# EAGLE schematic RDA5807FP_PINOUT (EAGLE 9.6.2)
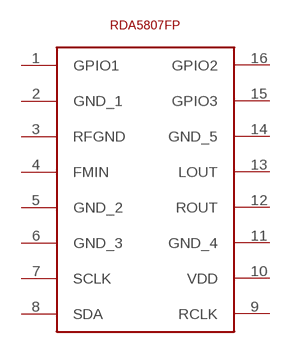
[diagram p0: schematic, sheet 1]

## Parts
U$1  RDA5807FPRDA5807FP  [RDA5807FP]
Unconnected: U$1.1(GPIO1) U$1.2(GND_1) U$1.3(RFGND) U$1.4(FMIN) U$1.5(GND_2) U$1.6(GND_3) U$1.7(SCLK) U$1.8(SDA) U$1.9(RCLK) U$1.10(VDD) U$1.11(GND_4) U$1.12(ROUT) U$1.13(LOUT) U$1.14(GND_5) U$1.15(GPIO3) U$1.16(GPIO2)

## Library data of the parts
U$1 = RDA5807FP:RDA5807FP